# Altium schematic sheet Sheet_STM32_CUBE.SchDoc
size A4
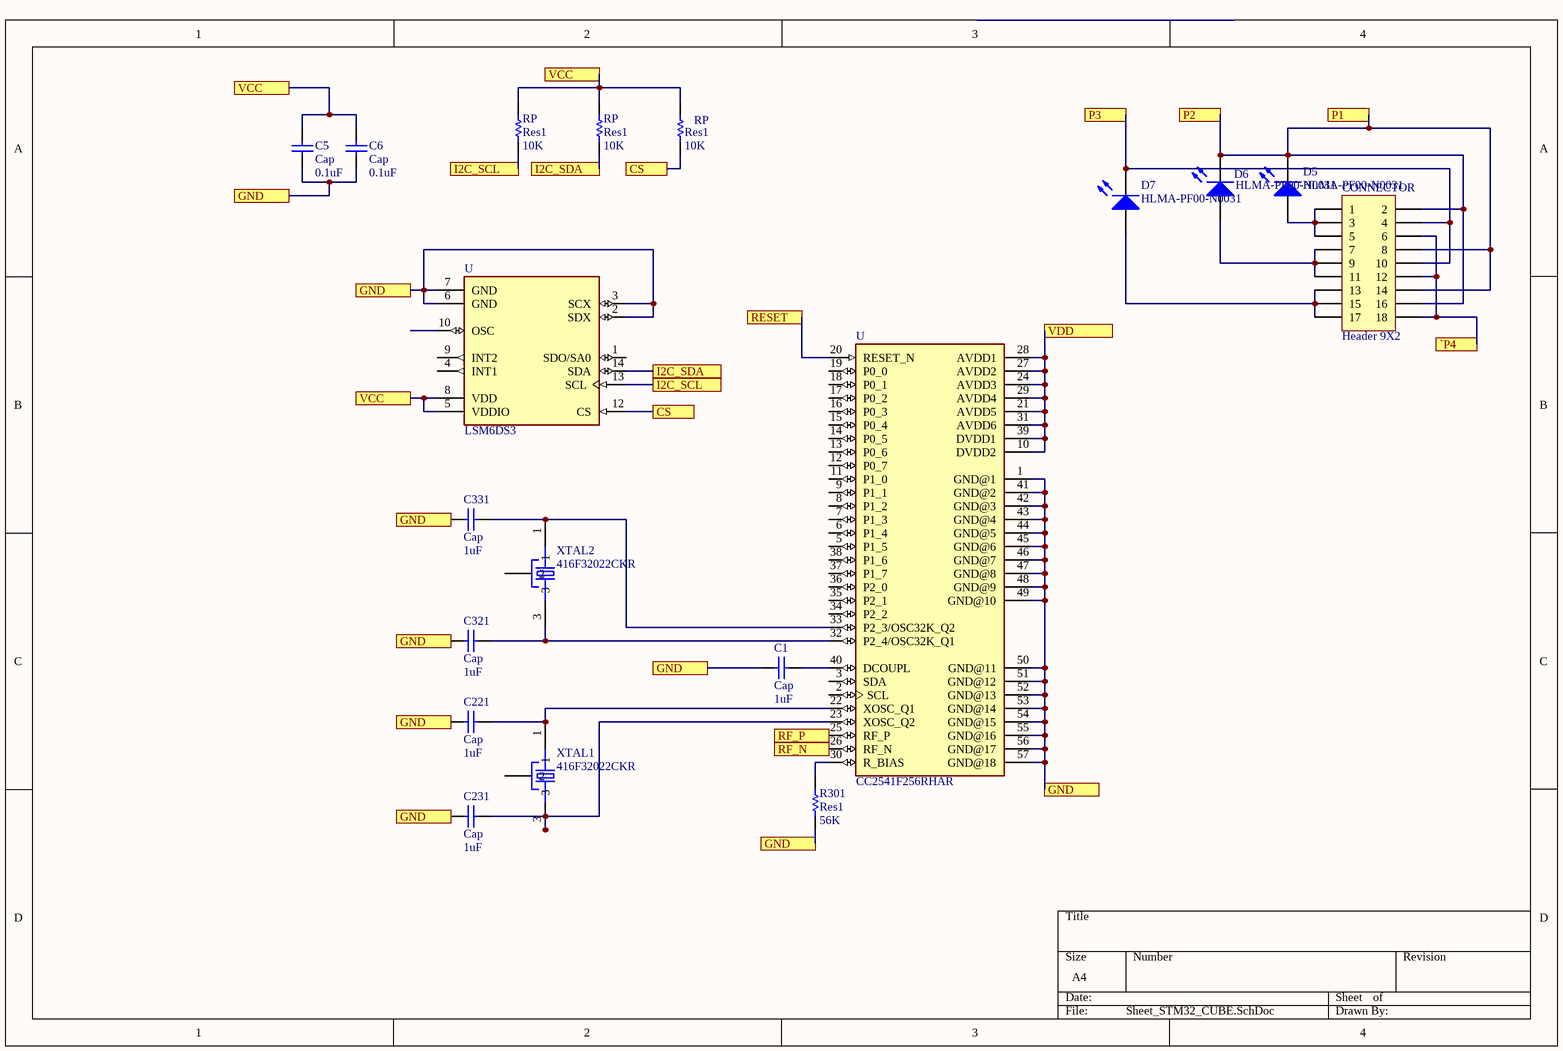
[diagram p0: Sheet_STM32_CUBE.SchDoc]

## Parts
(Parts that share a designator on the sheet are numbered #1, #2 ... from top to bottom, then left to right.)
C1  Cap  value 1uF  [RAD-0.3]
C5  Cap  value 0.1uF  [RAD-0.3]
C6  Cap  value 0.1uF  [RAD-0.3]
C221  Cap  value 1uF  [RAD-0.3]
C231  Cap  value 1uF  [RAD-0.3]
C321  Cap  value 1uF  [RAD-0.3]
C331  Cap  value 1uF  [RAD-0.3]
CONNECTOR  Header 9X2  [HDR2X9]
D5  HLMA-PF00-N0031  [2.2X2.1X2.2Z]
D6  HLMA-PF00-N0031  [2.2X2.1X2.2Z]
D7  HLMA-PF00-N0031  [2.2X2.1X2.2Z]
R301  Res1  R301: 56K  [AXIAL-0.3]
RP#1  Res1  R301: 10K  [AXIAL-0.3]
RP#2  Res1  R301: 10K  [AXIAL-0.3]
RP#3  Res1  R301: 10K  [AXIAL-0.3]
U#1  LSM6DS3  [PQFN50P300X250X86-14N]
U#2  CC2541F256RHAR  [QFN50P600X600X100-41N]
XTAL1  416F32022CKR  [OSCSC49P160X120X45-4N]
XTAL2  416F32022CKR  [OSCSC49P160X120X45-4N]

## Ports
`P4, CS, GND, I2C_SCL, I2C_SDA, P1, P2, P3, RESET, RF_N, RF_P, VCC, VDD

## Nets
`P4: CONNECTOR.6 CONNECTOR.12 CONNECTOR.18 ; port `P4
CS: RP#3.1 U#1.12(CS) ; port CS
GND: C1.1 C5.1 C6.1 C221.1 C231.1 C321.1 C331.1 R301.1 U#1.2(SDX) U#1.3(SCX) U#1.6(GND) U#1.7(GND) U#2.1(GND@1) U#2.41(GND@2) U#2.42(GND@3) U#2.43(GND@4) U#2.44(GND@5) U#2.45(GND@6) U#2.46(GND@7) U#2.47(GND@8) U#2.48(GND@9) U#2.49(GND@10) U#2.50(GND@11) U#2.51(GND@12) U#2.52(GND@13) U#2.53(GND@14) U#2.54(GND@15) U#2.55(GND@16) U#2.56(GND@17) U#2.57(GND@18) ; port GND
I2C_SCL: RP#1.1 U#1.13(SCL) ; port I2C_SCL
I2C_SDA: RP#2.1 U#1.14(SDA) ; port I2C_SDA
P1: CONNECTOR.2 CONNECTOR.8 CONNECTOR.14 CONNECTOR.16 D5.2(K) D6.2(K) ; port P1, port P2
P3: CONNECTOR.4 CONNECTOR.10 D7.2(K) ; port P3
RESET: U#2.20(RESET_N) ; port RESET
RF_N: U#2.26(RF_N) ; port RF_N
RF_P: U#2.25(RF_P) ; port RF_P
VCC: C5.2 C6.2 RP#1.2 RP#2.2 RP#3.2 U#1.5(VDDIO) U#1.8(VDD) ; port VCC
VDD: U#2.10(DVDD2) U#2.21(AVDD5) U#2.24(AVDD3) U#2.27(AVDD2) U#2.28(AVDD1) U#2.29(AVDD4) U#2.31(AVDD6) U#2.39(DVDD1) ; port VDD
NetC1_2: C1.2 U#2.40(DCOUPL)
NetC221_2: C221.2 U#2.22(XOSC_Q1) XTAL1.1
NetC231_2: C231.2 U#2.23(XOSC_Q2) XTAL1.3
NetC321_2: C321.2 U#2.32(P2_4/OSC32K_Q1) XTAL2.3
NetC331_2: C331.2 U#2.33(P2_3/OSC32K_Q2) XTAL2.1
NetCONNECTOR_1: CONNECTOR.1 CONNECTOR.3 CONNECTOR.5 D5.1(A)
NetCONNECTOR_7: CONNECTOR.7 CONNECTOR.9 CONNECTOR.11 D6.1(A)
NetCONNECTOR_13: CONNECTOR.13 CONNECTOR.15 CONNECTOR.17 D7.1(A)
NetR301_2: R301.2 U#2.30(R_BIAS)
NetXTAL1_2: XTAL1.2 XTAL1.4
NetXTAL2_2: XTAL2.2 XTAL2.4

Not connected (* = marked no-connect by the designer): U#1 1(SDO/SA0) 4(INT1) 9(INT2) 10(OSC); U#2 2(SCL) 3(SDA) 5(P1_5) 6(P1_4) 7(P1_3) 8(P1_2) 9(P1_1) 11(P1_0) 12(P0_7) 13(P0_6) 14(P0_5) 15(P0_4) 16(P0_3) 17(P0_2) 18(P0_1) 19(P0_0) 34(P2_2) 35(P2_1) 36(P2_0) 37(P1_7) 38(P1_6)

## Library data of the parts
C1 C5 C6 C221 C231 C321 C331 = Cap: Capacitor; Published: 8-Jun-2000; LatestRevisionDate: 17-Jul-2002; LatestRevisionNote: Re-released for DXP Platform.; PackageReference: RAD-0.3; Publisher: Altium Limited; PackageDescription: Radial Cap, Thru-Hole; 2 Leads; 0.3 in Pin Spacing
CONNECTOR = Header 9X2: Header, 9-Pin, Dual row; LatestRevisionDate: 17-Jul-2002; LatestRevisionNote: Re-released for DXP Platform.; Publisher: Altium Limited
D5-D7 = HLMA-PF00-N0031: Subminiature High Performance AlInGaP Red LED Lamp; LuminousIntensity: 25mcd (Minimum).; PCB_Layout: Complies with manufacturer's recommendation.; DrillSize: Nominal, Rounded to nearest 0.05mm; Published: 11-Dec-2002; DatasheetDocument: 24-Oct-2001; PackageDocument: 19-Apr-2001; PackageReference: 2.2X2.1X2.2Z; Publisher: Altium Limited; LED_Colour: Red; ComponentLink1Description: Manufacturer Link; ComponentLink1URL: http://www.agilent.com/; ComponentLink2Description: Datasheet; ComponentLink2URL: http://cp.literature.agilent.com/litweb/pdf/5988-4548EN.pdf
R301 RP#1-RP#3 = Res1: Resistor; Published: 8-Jun-2000; LatestRevisionDate: 17-Jul-2002; LatestRevisionNote: Re-released for DXP Platform.; PackageReference: AXIAL-0.3; Publisher: Altium Limited; PackageDescription: Axial Device, Thru-Hole; 2 Leads; 0.3 in Pin Spacing
U#1 = LSM6DS3: LSM6DS33 - Accelerometer, Gyroscope, 6 Axis Sensor Evaluation Board; MF: STMicroelectronics; Package: LGA-14 STMicroelectronics; MP: LSM6DS3; Value: *; Availability: Unavailable; Price: None; SnapEDA_Link: https://www.snapeda.com/parts/LSM6DS3/STMicroelectronics/view-part/106288/?ref=snap
U#2 = CC2541F256RHAR: IC RF TxRx + MCU Bluetooth Bluetooth v4.0 2.4GHz 40-VFQFN Exposed Pad; MF: Texas Instruments; MP: CC2541F256RHAR; Availability: Unavailable; SnapEDA_Link: https://www.snapeda.com/parts/CC2541F256RHAR/Texas%20Instruments/view-part/47705/?ref=snap; Package: VFQFN-40 Texas Instruments; Value: *; Price: None
XTAL1 XTAL2 = 416F32022CKR: 32MHz Â±20ppm Crystal 8pF 80 Ohms 4-SMD, No Lead; MF: CTS-Frequency; Package: SMD-4 CTS Components; MP: 416F32022CKR; Value: *; Availability: Unavailable; SnapEDA_Link: https://www.snapeda.com/parts/416F32022CKR/CTS-Frequency%20Controls/view-part/590969/?ref=snap; Price: None